# Altium schematic sheet 0034_PCH_CLOCK.SchDoc
size A3
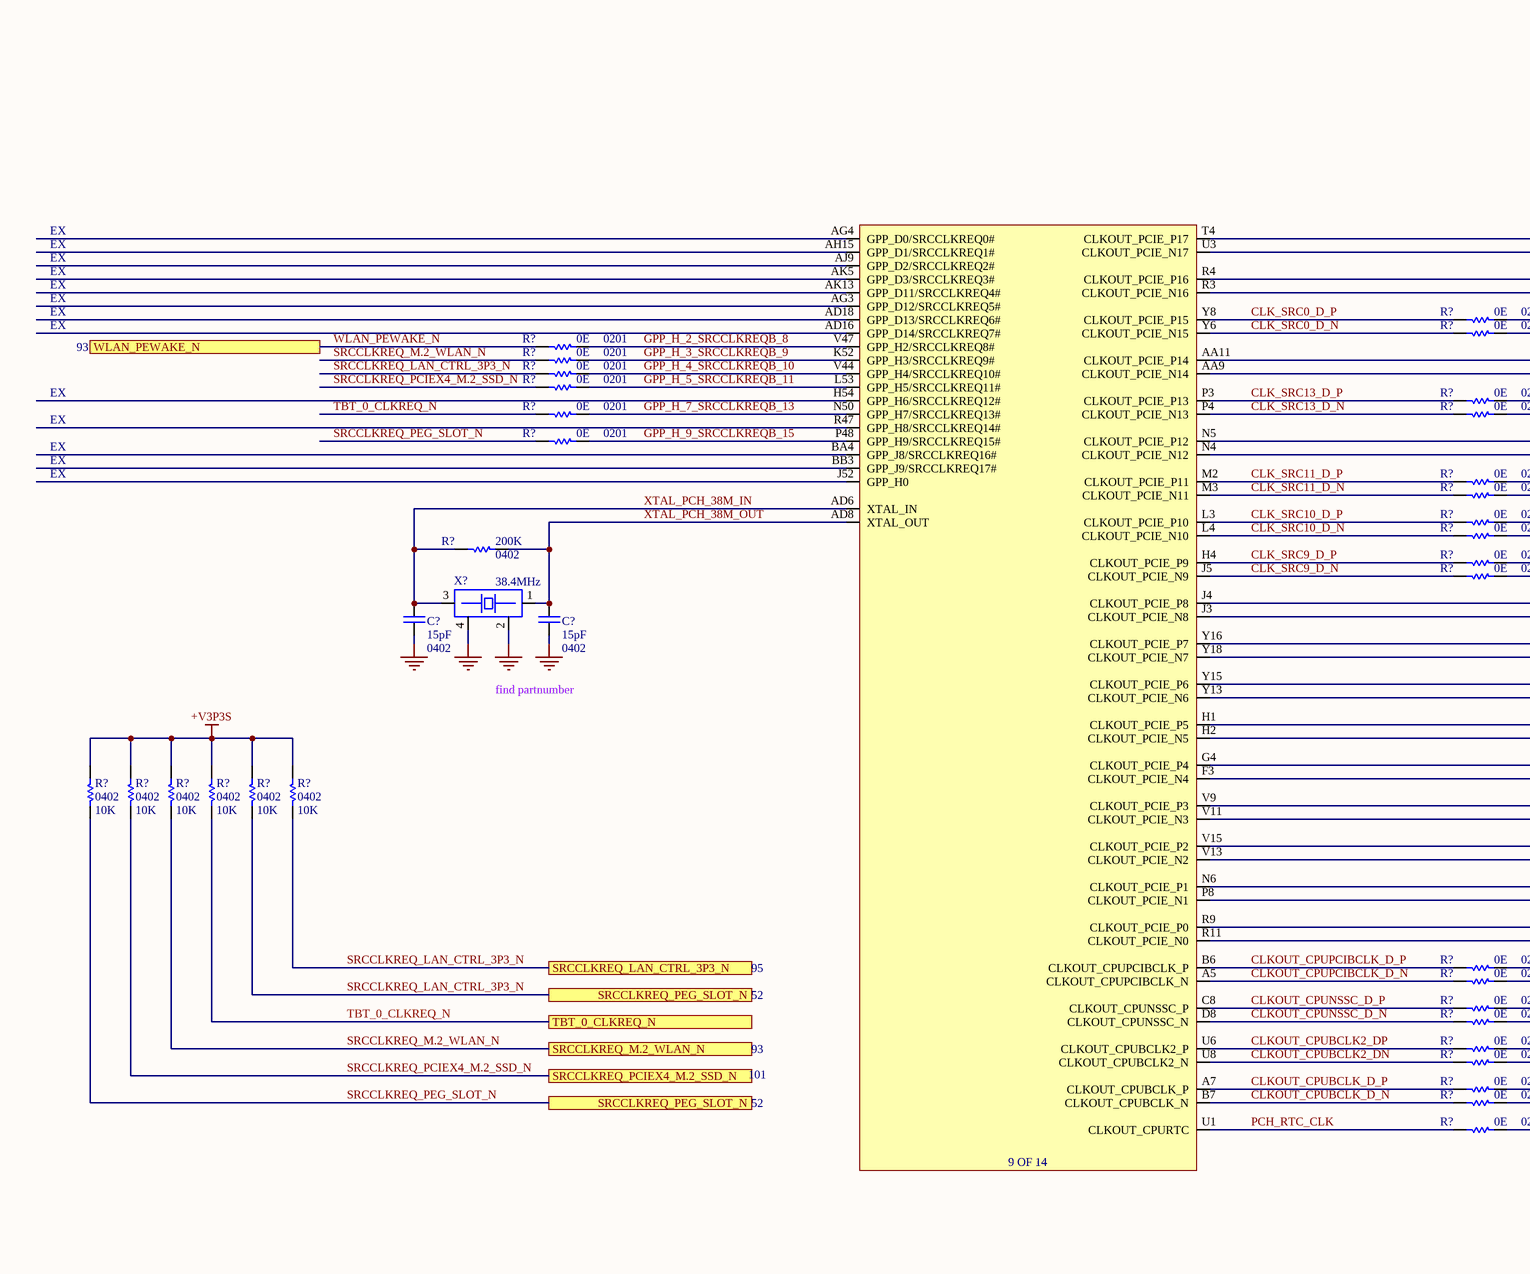
[diagram p0: 0034_PCH_CLOCK.SchDoc, bottom left]
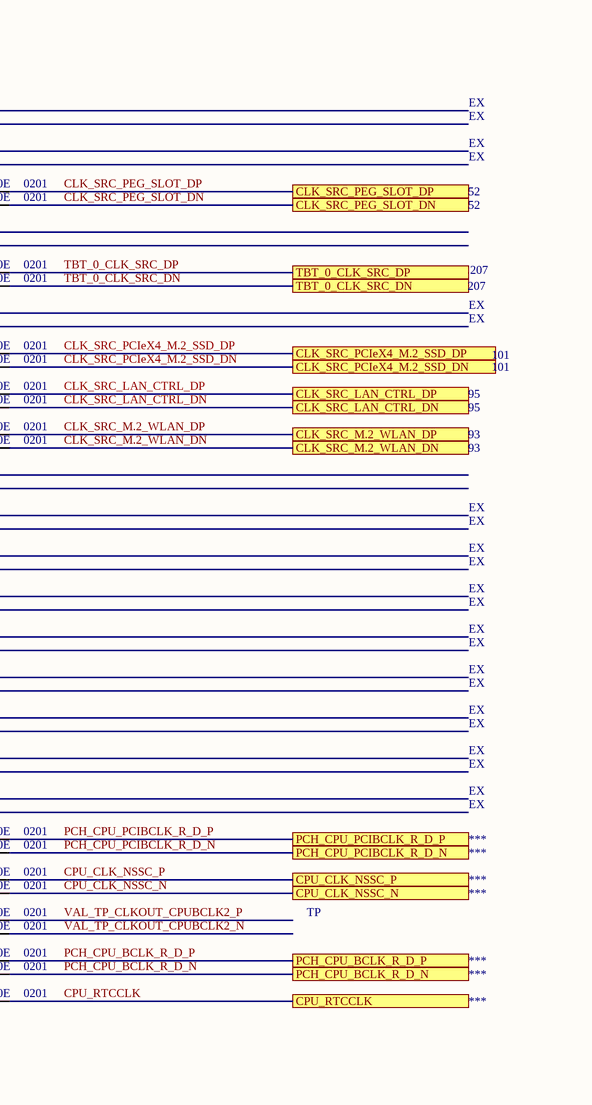
[diagram p1: 0034_PCH_CLOCK.SchDoc, bottom middle]

## Parts
(Parts that share a designator on the sheet are numbered #1, #2 ... from top to bottom, then left to right.)
C?#1  value 15pF  Case/Package: 0402  [CAPC0402]  (hidden comment: Cap)
C?#2  value 15pF  Case/Package: 0402  [CAPC0402]  (hidden comment: Cap)
R?#1  value 0E  Case/Package: 0201  [RESC0201]  (hidden comment: Res)
R?#2  value 0E  Case/Package: 0201  [RESC0201]  (hidden comment: Res)
R?#3  value 0E  Case/Package: 0201  [RESC0201]  (hidden comment: Res)
R?#4  value 0E  Case/Package: 0201  [RESC0201]  (hidden comment: Res)
R?#5  value 0E  Case/Package: 0201  [RESC0201]  (hidden comment: Res)
R?#6  value 0E  Case/Package: 0201  [RESC0201]  (hidden comment: Res)
R?#7  value 0E  Case/Package: 0201  [RESC0201]  (hidden comment: Res)
R?#8  value 0E  Case/Package: 0201  [RESC0201]  (hidden comment: Res)
R?#9  value 0E  Case/Package: 0201  [RESC0201]  (hidden comment: Res)
R?#10  value 0E  Case/Package: 0201  [RESC0201]  (hidden comment: Res)
R?#11  value 0E  Case/Package: 0201  [RESC0201]  (hidden comment: Res)
R?#12  value 0E  Case/Package: 0201  [RESC0201]  (hidden comment: Res)
R?#13  value 0E  Case/Package: 0201  [RESC0201]  (hidden comment: Res)
R?#14  value 0E  Case/Package: 0201  [RESC0201]  (hidden comment: Res)
R?#15  value 200K  Case/Package: 0402  [RESC0402]  (hidden comment: Res)
R?#16  value 0E  Case/Package: 0201  [RESC0201]  (hidden comment: Res)
R?#17  value 0E  Case/Package: 0201  [RESC0201]  (hidden comment: Res)
R?#18  value 10K  Case/Package: 0402  [RESC0402]  (hidden comment: Res)
R?#19  value 10K  Case/Package: 0402  [RESC0402]  (hidden comment: Res)
R?#20  value 10K  Case/Package: 0402  [RESC0402]  (hidden comment: Res)
R?#21  value 10K  Case/Package: 0402  [RESC0402]  (hidden comment: Res)
R?#22  value 10K  Case/Package: 0402  [RESC0402]  (hidden comment: Res)
R?#23  value 10K  Case/Package: 0402  [RESC0402]  (hidden comment: Res)
R?#24  value 0E  Case/Package: 0201  [RESC0201]  (hidden comment: Res)
R?#25  value 0E  Case/Package: 0201  [RESC0201]  (hidden comment: Res)
R?#26  value 0E  Case/Package: 0201  [RESC0201]  (hidden comment: Res)
R?#27  value 0E  Case/Package: 0201  [RESC0201]  (hidden comment: Res)
R?#28  value 0E  Case/Package: 0201  [RESC0201]  (hidden comment: Res)
R?#29  value 0E  Case/Package: 0201  [RESC0201]  (hidden comment: Res)
R?#30  value 0E  Case/Package: 0201  [RESC0201]  (hidden comment: Res)
R?#31  value 0E  Case/Package: 0201  [RESC0201]  (hidden comment: Res)
R?#32  value 0E  Case/Package: 0201  [RESC0201]  (hidden comment: Res)
U?  C_RPL_S_PCH_EXT  (value not drawn)  (part I of 14)
X?  value 38.4MHz  [Crystal_3225]  (hidden comment: C389863)

## Ports
CLK_SRC_LAN_CTRL_DN, CLK_SRC_LAN_CTRL_DP, CLK_SRC_M.2_WLAN_DN, CLK_SRC_M.2_WLAN_DP, CLK_SRC_PCIeX4_M.2_SSD_DN, CLK_SRC_PCIeX4_M.2_SSD_DP, CLK_SRC_PEG_SLOT_DN, CLK_SRC_PEG_SLOT_DP, CPU_CLK_NSSC_N, CPU_CLK_NSSC_P, CPU_RTCCLK, PCH_CPU_BCLK_R_D_N, PCH_CPU_BCLK_R_D_P, PCH_CPU_PCIBCLK_R_D_N, PCH_CPU_PCIBCLK_R_D_P, SRCCLKREQ_LAN_CTRL_3P3_N, SRCCLKREQ_M.2_WLAN_N, SRCCLKREQ_PCIEX4_M.2_SSD_N, SRCCLKREQ_PEG_SLOT_N, TBT_0_CLK_SRC_DN, TBT_0_CLK_SRC_DP, TBT_0_CLKREQ_N, WLAN_PEWAKE_N

## Nets
+V3P3S: R?#18.2 R?#19.2 R?#20.2 R?#21.2 R?#22.2 R?#23.2
GND: C?#1.1 C?#2.1 X?.2 X?.4
CLK_SRC0_D_N: R?#2.1 U?.Y6(CLKOUT_PCIE_N15)
CLK_SRC0_D_P: R?#1.1 U?.Y8(CLKOUT_PCIE_P15)
CLK_SRC9_D_N: R?#17.1 U?.J5(CLKOUT_PCIE_N9)
CLK_SRC9_D_P: R?#16.1 U?.H4(CLKOUT_PCIE_P9)
CLK_SRC10_D_N: R?#14.1 U?.L4(CLKOUT_PCIE_N10)
CLK_SRC10_D_P: R?#13.1 U?.L3(CLKOUT_PCIE_P10)
CLK_SRC11_D_N: R?#12.1 U?.M3(CLKOUT_PCIE_N11)
CLK_SRC11_D_P: R?#11.1 U?.M2(CLKOUT_PCIE_P11)
CLK_SRC13_D_N: R?#9.1 U?.P4(CLKOUT_PCIE_N13)
CLK_SRC13_D_P: R?#7.1 U?.P3(CLKOUT_PCIE_P13)
CLK_SRC_LAN_CTRL_DN: R?#14.2 ; port CLK_SRC_LAN_CTRL_DN
CLK_SRC_LAN_CTRL_DP: R?#13.2 ; port CLK_SRC_LAN_CTRL_DP
CLK_SRC_M.2_WLAN_DN: R?#17.2 ; port CLK_SRC_M.2_WLAN_DN
CLK_SRC_M.2_WLAN_DP: R?#16.2 ; port CLK_SRC_M.2_WLAN_DP
CLK_SRC_PCIeX4_M.2_SSD_DN: R?#12.2 ; port CLK_SRC_PCIeX4_M.2_SSD_DN
CLK_SRC_PCIeX4_M.2_SSD_DP: R?#11.2 ; port CLK_SRC_PCIeX4_M.2_SSD_DP
CLK_SRC_PEG_SLOT_DN: R?#2.2 ; port CLK_SRC_PEG_SLOT_DN
CLK_SRC_PEG_SLOT_DP: R?#1.2 ; port CLK_SRC_PEG_SLOT_DP
CLKOUT_CPUBCLK2_DN: R?#29.1 U?.U8(CLKOUT_CPUBCLK2_N)
CLKOUT_CPUBCLK2_DP: R?#28.1 U?.U6(CLKOUT_CPUBCLK2_P)
CLKOUT_CPUBCLK_D_N: R?#31.1 U?.B7(CLKOUT_CPUBCLK_N)
CLKOUT_CPUBCLK_D_P: R?#30.1 U?.A7(CLKOUT_CPUBCLK_P)
CLKOUT_CPUNSSC_D_N: R?#27.1 U?.D8(CLKOUT_CPUNSSC_N)
CLKOUT_CPUNSSC_D_P: R?#26.1 U?.C8(CLKOUT_CPUNSSC_P)
CLKOUT_CPUPCIBCLK_D_N: R?#25.1 U?.A5(CLKOUT_CPUPCIBCLK_N)
CLKOUT_CPUPCIBCLK_D_P: R?#24.1 U?.B6(CLKOUT_CPUPCIBCLK_P)
CPU_CLK_NSSC_N: R?#27.2 ; port CPU_CLK_NSSC_N
CPU_CLK_NSSC_P: R?#26.2 ; port CPU_CLK_NSSC_P
CPU_RTCCLK: R?#32.2 ; port CPU_RTCCLK
GPP_H_2_SRCCLKREQB_8: R?#3.2 U?.V47(GPP_H2/SRCCLKREQ8#)
GPP_H_3_SRCCLKREQB_9: R?#4.2 U?.K52(GPP_H3/SRCCLKREQ9#)
GPP_H_4_SRCCLKREQB_10: R?#5.2 U?.V44(GPP_H4/SRCCLKREQ10#)
GPP_H_5_SRCCLKREQB_11: R?#6.2 U?.L53(GPP_H5/SRCCLKREQ11#)
GPP_H_7_SRCCLKREQB_13: R?#8.2 U?.N50(GPP_H7/SRCCLKREQ13#)
GPP_H_9_SRCCLKREQB_15: R?#10.2 U?.P48(GPP_H9/SRCCLKREQ15#)
PCH_CPU_BCLK_R_D_N: R?#31.2 ; port PCH_CPU_BCLK_R_D_N
PCH_CPU_BCLK_R_D_P: R?#30.2 ; port PCH_CPU_BCLK_R_D_P
PCH_CPU_PCIBCLK_R_D_N: R?#25.2 ; port PCH_CPU_PCIBCLK_R_D_N
PCH_CPU_PCIBCLK_R_D_P: R?#24.2 ; port PCH_CPU_PCIBCLK_R_D_P
PCH_RTC_CLK: R?#32.1 U?.U1(CLKOUT_CPURTC)
SRCCLKREQ_LAN_CTRL_3P3_N: R?#5.1 R?#10.1 R?#18.1 R?#22.1 R?#23.1 ; port SRCCLKREQ_PEG_SLOT_N, port SRCCLKREQ_LAN_CTRL_3P3_N  [also labelled SRCCLKREQ_PEG_SLOT_N]
SRCCLKREQ_M.2_WLAN_N: R?#4.1 R?#20.1 ; port SRCCLKREQ_M.2_WLAN_N
SRCCLKREQ_PCIEX4_M.2_SSD_N: R?#6.1 R?#19.1 ; port SRCCLKREQ_PCIEX4_M.2_SSD_N
TBT_0_CLK_SRC_DN: R?#9.2 ; port TBT_0_CLK_SRC_DN
TBT_0_CLK_SRC_DP: R?#7.2 ; port TBT_0_CLK_SRC_DP
TBT_0_CLKREQ_N: R?#8.1 R?#21.1 ; port TBT_0_CLKREQ_N
VAL_TP_CLKOUT_CPUBCLK2_N: R?#29.2
VAL_TP_CLKOUT_CPUBCLK2_P: R?#28.2
WLAN_PEWAKE_N: R?#3.1 ; port WLAN_PEWAKE_N
XTAL_PCH_38M_IN: C?#1.2 R?#15.2 U?.AD6(XTAL_IN) X?.3
XTAL_PCH_38M_OUT: C?#2.2 R?#15.1 U?.AD8(XTAL_OUT) X?.1

Not connected (* = marked no-connect by the designer): U? AA9(CLKOUT_PCIE_N14) AA11(CLKOUT_PCIE_P14) AD16(GPP_D14/SRCCLKREQ7#) AD18(GPP_D13/SRCCLKREQ6#) AG3(GPP_D12/SRCCLKREQ5#) AG4(GPP_D0/SRCCLKREQ0#) AH15(GPP_D1/SRCCLKREQ1#) AJ9(GPP_D2/SRCCLKREQ2#) AK5(GPP_D3/SRCCLKREQ3#) AK13(GPP_D11/SRCCLKREQ4#) BA4(GPP_J8/SRCCLKREQ16#) BB3(GPP_J9/SRCCLKREQ17#) F3(CLKOUT_PCIE_N4) G4(CLKOUT_PCIE_P4) H1(CLKOUT_PCIE_P5) H2(CLKOUT_PCIE_N5) H54(GPP_H6/SRCCLKREQ12#) J3(CLKOUT_PCIE_N8) J4(CLKOUT_PCIE_P8) J52(GPP_H0) N4(CLKOUT_PCIE_N12) N5(CLKOUT_PCIE_P12) N6(CLKOUT_PCIE_P1) P8(CLKOUT_PCIE_N1) R3(CLKOUT_PCIE_N16) R4(CLKOUT_PCIE_P16) R9(CLKOUT_PCIE_P0) R11(CLKOUT_PCIE_N0) R47(GPP_H8/SRCCLKREQ14#) T4(CLKOUT_PCIE_P17) U3(CLKOUT_PCIE_N17) V9(CLKOUT_PCIE_P3) V11(CLKOUT_PCIE_N3) V13(CLKOUT_PCIE_N2) V15(CLKOUT_PCIE_P2) Y13(CLKOUT_PCIE_N6) Y15(CLKOUT_PCIE_P6) Y16(CLKOUT_PCIE_P7) Y18(CLKOUT_PCIE_N7)

## Notes on the sheet
- EX
- find partnumber
- TP
- (in symbol C_RPL_S_PCH_EXT, part I) 9 OF 14

## Library data of the parts
C?#1 C?#2 = Cap: CAP CER 15PF 50V NPO 0402; Manufacturer Part Number: CC0402GRNPO9BN240
R?#1-R?#14 R?#16 R?#17 R?#24-R?#32 = Res: Thick Film Resistor -  0ohm, 1%, 0201
R?#15 = Res: Thick Film Resistor -  200Kohm, 1%, 0402
R?#18-R?#23 = Res: Thick Film Resistor -  10Kohm, 1%, 0402
X? = CRYSTAL_1: 38.4MHz ±20ppm Crystal 6.5pF SMD3225; ComponentLink1URL: https://www.verical.com/server-webapp/html/getDatasheet?partID=757227&src-supplier=Verical; ComponentLink1Description: https://www.verical.com/server-webapp/html/getDatasheet?partID=757227&src-supplier=Verical; ComponentLink2URL: http://www.txccrystal.com/images/pdf/7m-accuracy.pdf?src-supplier=Digi-Key; ComponentLink2Description: http://www.txccrystal.com/images/pdf/7m-accuracy.pdf?src-supplier=Digi-Key; ComponentLink3URL: http://www.farnell.com/datasheets/1794111.pdf?src-supplier=Element14; ComponentLink3Description: http://www.farnell.com/datasheets/1794111.pdf?src-supplier=Element14; ComponentLink4URL: http://www.mouser.com/ds/2/417/7m-11184.pdf?src-supplier=Mouser; ComponentLink4Description: http://www.mouser.com/ds/2/417/7m-11184.pdf?src-supplier=Mouser; Case/Package: 3225; Load Capacitance: 6.5pF; ComponentLink5URL: http://www.ecsxtal.com/store/pdf/ecx-32.pdf?src-supplier=Digi-Key; ComponentLink5Description: http://www.ecsxtal.com/store/pdf/ecx-32.pdf?src-supplier=Digi-Key
U? = C_RPL_S_PCH_EXT: Manufacturer Part Number: *; Case/Package: *